# Altium schematic sheet 原理图.SchDoc
size A4
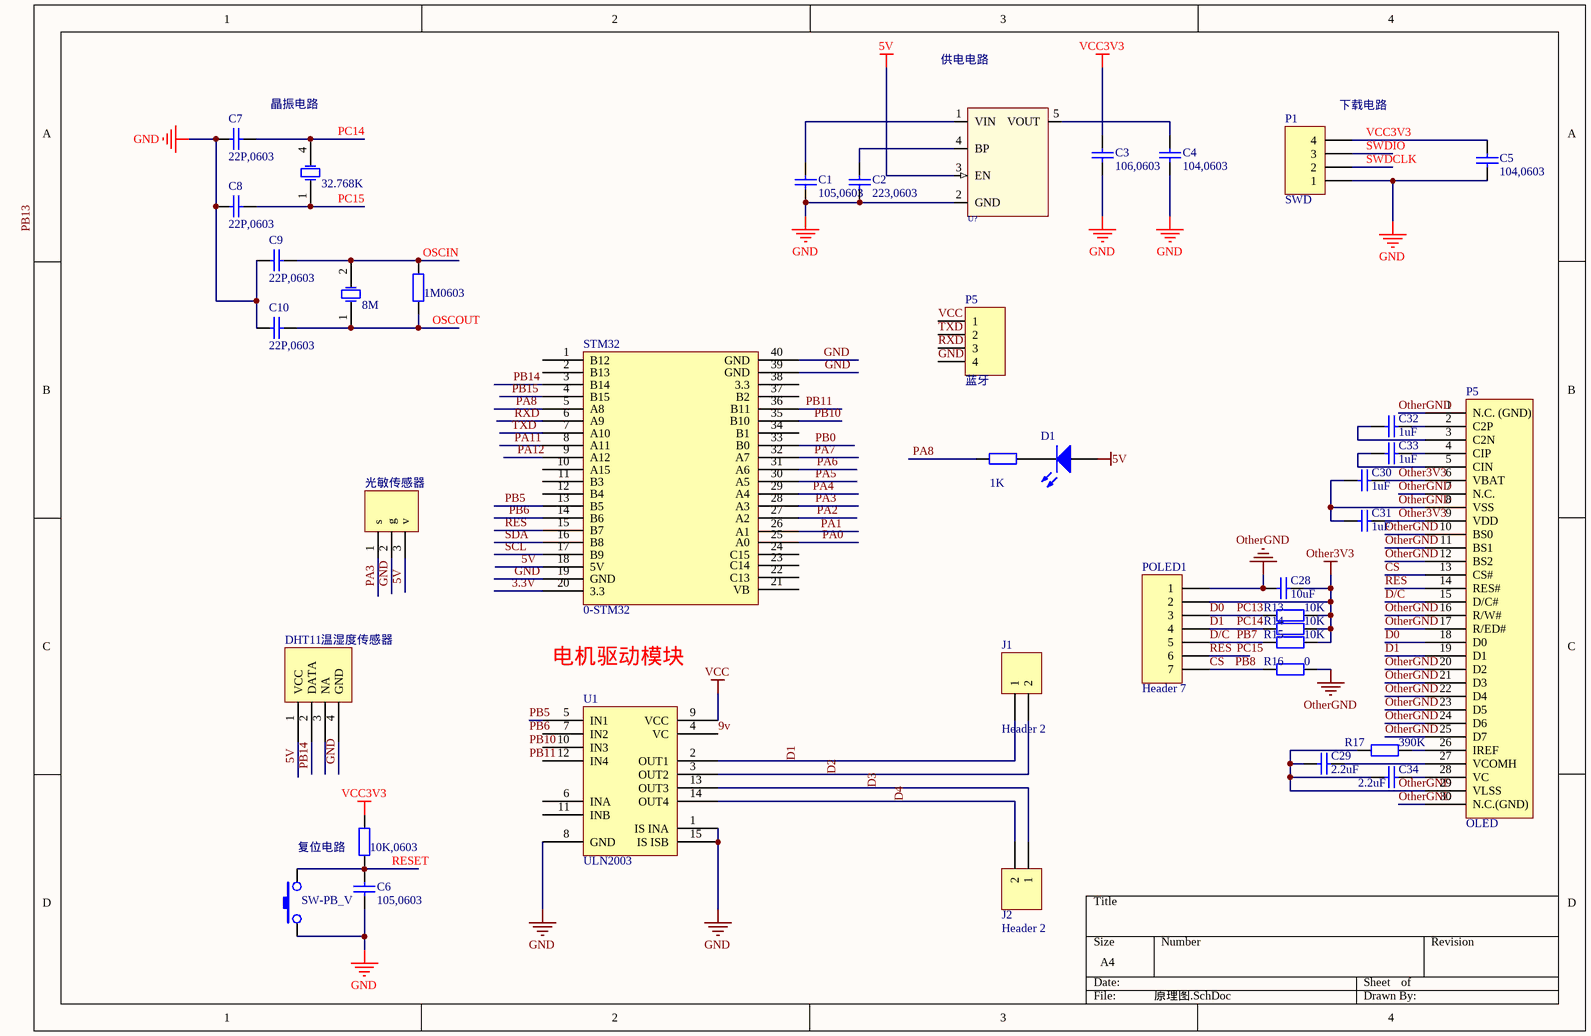
[diagram p0: 原理图.SchDoc]

## Parts
(Parts that share a designator on the sheet are numbered #1, #2 ... from top to bottom, then left to right.)
?#1  32.768K  [MC-306]
?#2  8M  [XTAL-49S DIP]
?#3  1M0603  [R 0603]
?#4  10K,0603  [R 0603]
?#5  SW-PB_V  [TSW SMD-3*6*2.5]
C1  105,0603  [C 0603]
C2  223,0603  [C 0603]
C3  106,0603  [C 0603]
C4  104,0603  [C 0603]
C5  104,0603  [C 0603]
C6  105,0603  [C 0603]
C7  22P,0603  [C 0603]
C8  22P,0603  [C 0603]
C9  22P,0603  [C 0603]
C10  22P,0603  [C 0603]
C28  10uF  [0603C]
C29  2.2uF  [0603C]
C30  1uF  [0603C]
C31  1uF  [0603C]
C32  1uF  [0603C]
C33  1uF  [0603C]
C34  2.2uF  [0603C]
D1  (no value)  [LED]
DHT11温湿度传感器  (no value)  [dht11]
J1  Header 2  [HDR1X2]
J2  Header 2  [HDR1X2]
P1  SWD  [HDR-1X4_H]
P5#1  蓝牙  [HDR1X4]
P5#2  OLED  [OLED-luoping]
POLED1  Header 7  [HDR1X7]
R1  value 1K  [res]  (hidden comment: 3-Res)
R13  value 10K  [0603R]  (hidden comment: RES)
R14  value 10K  [0603R]  (hidden comment: RES)
R15  value 10K  [0603R]  (hidden comment: RES)
R16  value 0  [0603R]  (hidden comment: RES)
R17  value 390K  [0603R]  (hidden comment: RES)
STM32  0-STM32  [STM32]
U1  ULN2003  [DIP20]
U?  RT9193  [SOT23-5L]  (value not drawn)
光敏传感器  5-guangzhao  [GZ]  (value not drawn)

## Nets
5V: D1.1(A) DHT11温湿度传感器.1(VCC) STM32.18(5V) U?.3(EN) 光敏传感器.3(v)
GND: ?#5.1 C1.1 C2.1 C3.2 C4.1 C5.1 C6.1 C7.2 C8.2 C9.2 C10.2 DHT11温湿度传感器.4(GND) P1.1 P5#1.4 STM32.19(GND) STM32.39(GND) STM32.40(GND) U1.1(IS_INA) U1.8(GND) U1.15(IS_ISB) U?.2(GND) 光敏传感器.2(g)
Other3V3: C28.1 C30.1 C31.1 P5#2.6(VBAT) P5#2.9(VDD) POLED1.2 R13.2 R14.2 R15.2
OtherGND: C28.2 C29.2 C30.2 C31.2 C34.2 P5#2.1(N.C._(GND)) P5#2.7(N.C.) P5#2.8(VSS) P5#2.10(BS0) P5#2.11(BS1) P5#2.12(BS2) P5#2.16(R/W#) P5#2.17(R/ED#) P5#2.20(D2) P5#2.21(D3) P5#2.22(D4) P5#2.23(D5) P5#2.24(D6) P5#2.25(D7) P5#2.29(VLSS) P5#2.30(N.C.(GND)) POLED1.1 R16.2 R17.1
VCC: P5#1.1 U1.9(VCC)
VCC3V3: ?#4.2 C3.1 C5.2 P1.4
3.3V: STM32.20(3.3)
9v: U1.4(VC)
CS: P5#2.13(CS#) POLED1.7 R16.1  [also labelled PB8]
D0: P5#2.18(D0) POLED1.3 R13.1  [also labelled PC13]
D1: ?#1.4(OSC2) C7.1 J1.1 P5#2.19(D1) POLED1.4 R14.1 U1.2(OUT1)  [also labelled PC14]
D2: J1.2 U1.3(OUT2)
D3: J2.1 U1.13(OUT3)
D4: J2.2 U1.14(OUT4)
D/C: P5#2.15(D/C#) POLED1.5 R15.1  [also labelled PB7]
OSCIN: ?#2.2(OSC2) ?#3.2 C9.1
OSCOUT: ?#2.1(OSC1) ?#3.1 C10.1
PA0: STM32.25(A0)
PA1: STM32.26(A1)
PA2: STM32.27(A2)
PA3: STM32.28(A3) 光敏传感器.1(s)
PA4: STM32.29(A4)
PA5: STM32.30(A5)
PA6: STM32.31(A6)
PA7: STM32.32(A7)
PA8: R1.1 STM32.5(A8)
PA11: STM32.8(A11)
PA12: STM32.9(A12)
PB0: STM32.33(B0)
PB5: STM32.13(B5) U1.5(IN1)
PB6: STM32.14(B6)
PB10: STM32.35(B10)
PB11: STM32.36(B11)
PB14: DHT11温湿度传感器.2(DATA) STM32.3(B14)
PB15: STM32.4(B15)
PC15: ?#1.1(OSC1) C8.1 P5#2.14(RES#) POLED1.6 STM32.15(B7)  [also labelled RES]
RESET: ?#4.1 ?#5.2 C6.2
RXD: P5#1.3 STM32.6(A9)
SCL: STM32.17(B9)
SDA: STM32.16(B8)
SWDCLK: P1.2
SWDIO: P1.3
TXD: P5#1.2 STM32.7(A10)
NetC1_2: C1.2 U?.1(VIN)
NetC2_2: C2.2 U?.4(BP)
NetC4_2: C4.2 U?.5(VOUT)
NetC29_1: C29.1 P5#2.27(VCOMH)
NetC32_1: C32.1 P5#2.2(C2P)
NetC32_2: C32.2 P5#2.3(C2N)
NetC33_1: C33.1 P5#2.4(CIP)
NetC33_2: C33.2 P5#2.5(CIN)
NetC34_1: C34.1 P5#2.28(VC)
NetD1_2: D1.2(K) R1.2
NetP5#2_26: P5#2.26(IREF) R17.2

Not connected (* = marked no-connect by the designer): DHT11温湿度传感器 3(NA); STM32 1(B12) 2(B13) 10(A15) 11(B3) 12(B4) 21(VB) 22(C13) 23(C14) 24(C15) 34(B1) 37(B2) 38(3.3); U1 6(INA) 7(IN2) 10(IN3) 11(INB) 12(IN4)

## Notes on the sheet
- (near C7) 晶振电路
- 供电电路
- (near P1) 下载电路
- 电机驱动模块
- (near C6) 复位电路
- Labels drawn without touching a wire or pin: PB6, PB10, PB11, PB13

## Library data of the parts
?#1 ?#2 = XTAL: Crystal Oscillator; Published: 8-Jun-2000; LatestRevisionDate: 17-Jul-2002; LatestRevisionNote: Re-released for DXP Platform.; Publisher: Altium Limited
?#3 ?#4 = Res2: Resistor; Published: 8-Jun-2000; LatestRevisionDate: 17-Jul-2002; LatestRevisionNote: Re-released for DXP Platform.; Publisher: Altium Limited
?#5 = SW-PB_V: SWITCH
C1-C10 = Cap: Capacitor; Value: 104; Published: 8-Jun-2000; LatestRevisionDate: 17-Jul-2002; LatestRevisionNote: Re-released for DXP Platform.; Publisher: Altium Limited
C28-C34 = CAP
  C28: Value: 10uF
  C29 C34: Value: 2.2uF
  C30-C33: Value: 1uF
D1 = 15-led: Typical RED GaAs LED
DHT11温湿度传感器 = dht11
J1 J2 = Header 2: Header, 2-Pin; LatestRevisionDate: 17-Jul-2002; LatestRevisionNote: Re-released for DXP Platform.; Publisher: Altium Limited
P1 P5#1 = Header 4: Header, 4-Pin; LatestRevisionDate: 17-Jul-2002; LatestRevisionNote: Re-released for DXP Platform.; Publisher: Altium Limited
P5#2 = OLED-luoping: Value: OLED
POLED1 = Header 7: Header, 7-Pin; LatestRevisionDate: 17-Jul-2002; LatestRevisionNote: Re-released for DXP Platform.; Publisher: Altium Limited
U1 = L298: 电机驱动
U? = RT9193X_5P: ICA_MFR_NAME: RICHTEK; ICA_PARTNUM: $$2191094$$RT9193-15CU5; Part Number: TMP-13